# EAGLE design BatteryPower (EAGLE 6.5.0)
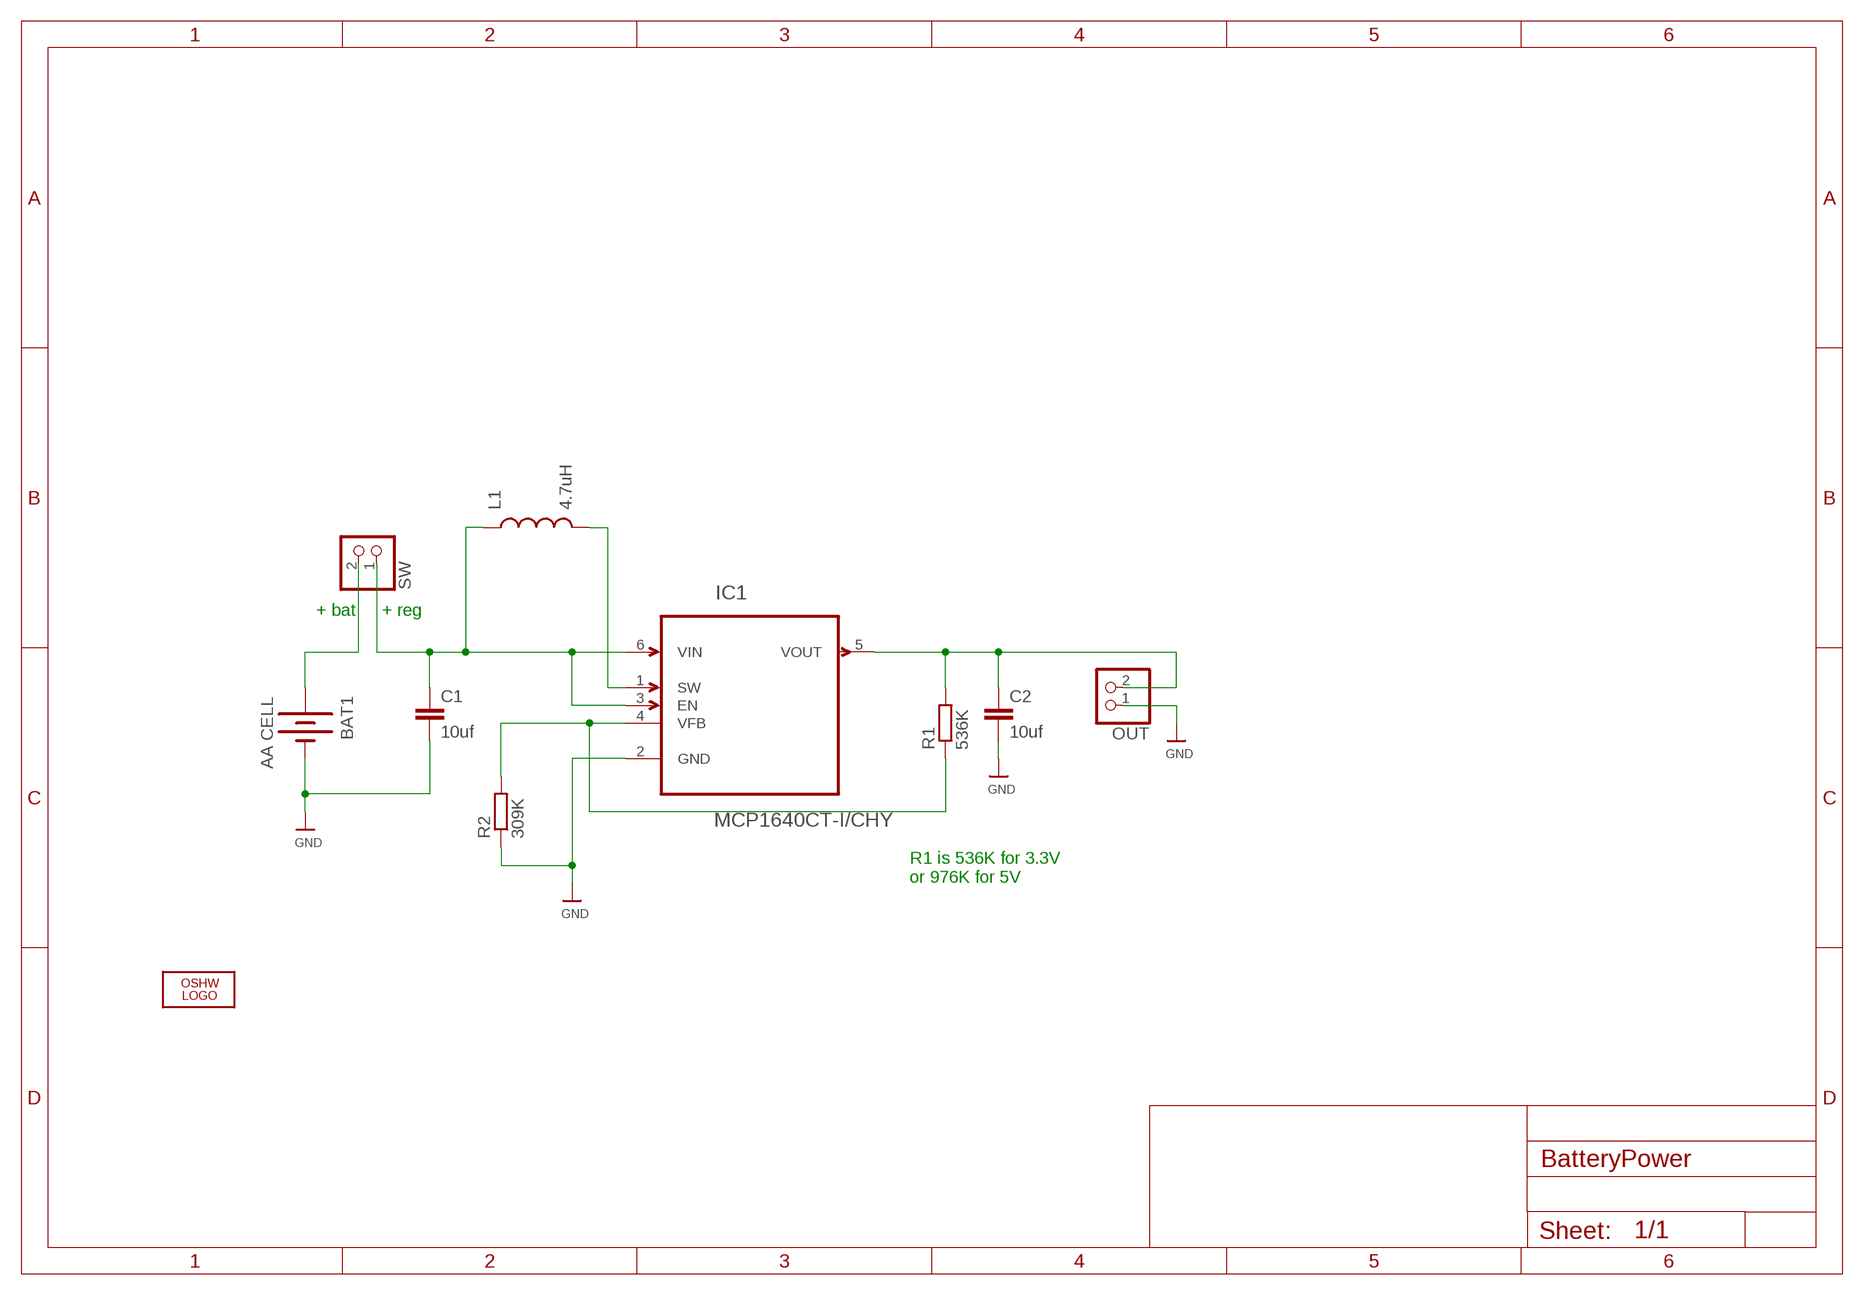
[diagram p0: schematic, sheet 1]

## Parts
BAT1  AA CELL  BATTERYAA  [BATTERY-AA]
C1  10uf  C-EUC0805  [C0805]
C2  10uf  C-EUC0805  [C0805]
IC1  MCP1640CT-I/CHY  [SOT95P270X145-6N]
L1  4.7uH  INDUCTORCR75  [CR75]
LOGO1  OSHW_LOGO_8MILX0150-NT  [OSHW_8X150_NOTEXT]
OUT  PINHD-1X2/90  [1X02/90]
R1  536K  R-EU_R0603  [R0603]
R2  309K  R-EU_R0603  [R0603]
SW  PINHD-1X2/90  [1X02/90]

## Nets
GND: BAT1.GND@1(-) C1.2 C2.2 IC1.2(GND) OUT.1 R2.1
N$1: C1.1 IC1.3(EN) IC1.6(VIN) L1.P$1 SW.1
N$2: IC1.1(SW) L1.P$2
N$5: IC1.4(VFB) R1.1 R2.2
N$6: C2.1 IC1.5(VOUT) OUT.2 R1.2
N$8: BAT1.PWR@1(+) SW.2

## Notes on the sheet
- + bat | + reg
- R1 is 536K for 3.3V
  or 976K for 5V

## Library data of the parts
BAT1 = SparkFun:BATTERY: Battery Holders Various common sizes : AA, AAA, 20mm coin cell and 12mm coin cell.
C1 C2 = rcl:C-EU: CAPACITOR, European symbol
IC1 = MCP1640:MCP1640CT-I/CHY: Synchronous Boost Regulator; MPN: MCP1640CT-I/CHY; OC_FARNELL: 1800208; OC_NEWARK: 73R3626; PACKAGE: SOT-6; SUPPLIER: Microchip
L1 = SparkFun:INDUCTOR: Inductors Basic Inductor/Choke - 0603 and 1206. Footprints are not proven and vary greatly between part numbers.
LOGO1 = ohw-logo:OSHW_LOGO_8MIL
OUT SW = pinhead:PINHD-1X2: PIN HEADER
R1 R2 = rcl:R-EU_: RESISTOR, European symbol

## Board
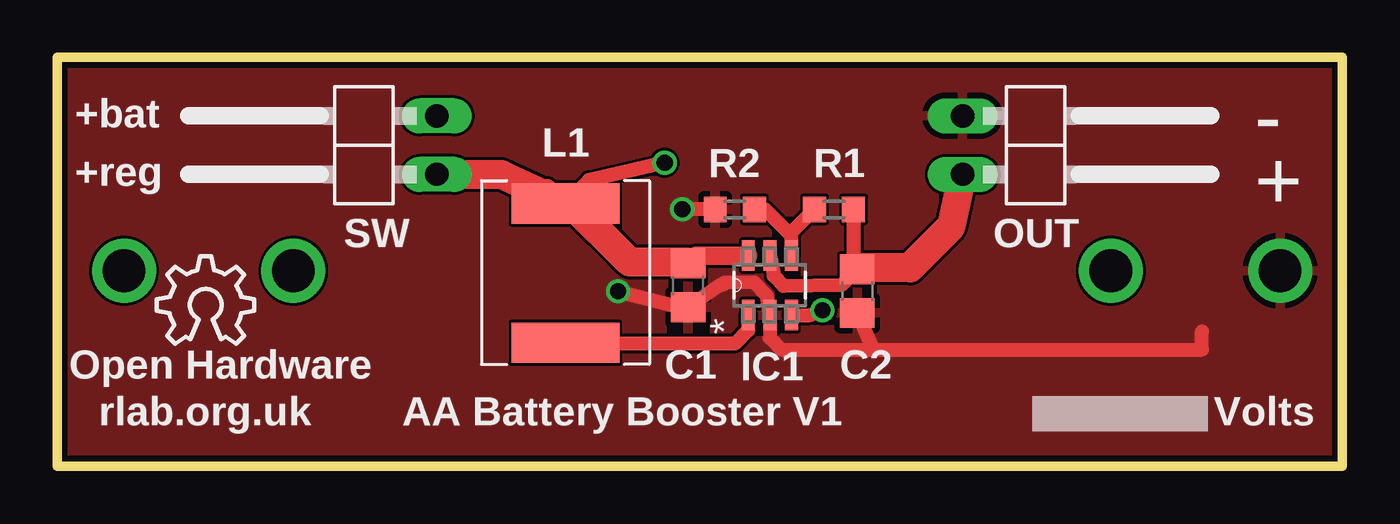
[diagram p1: board, top side]
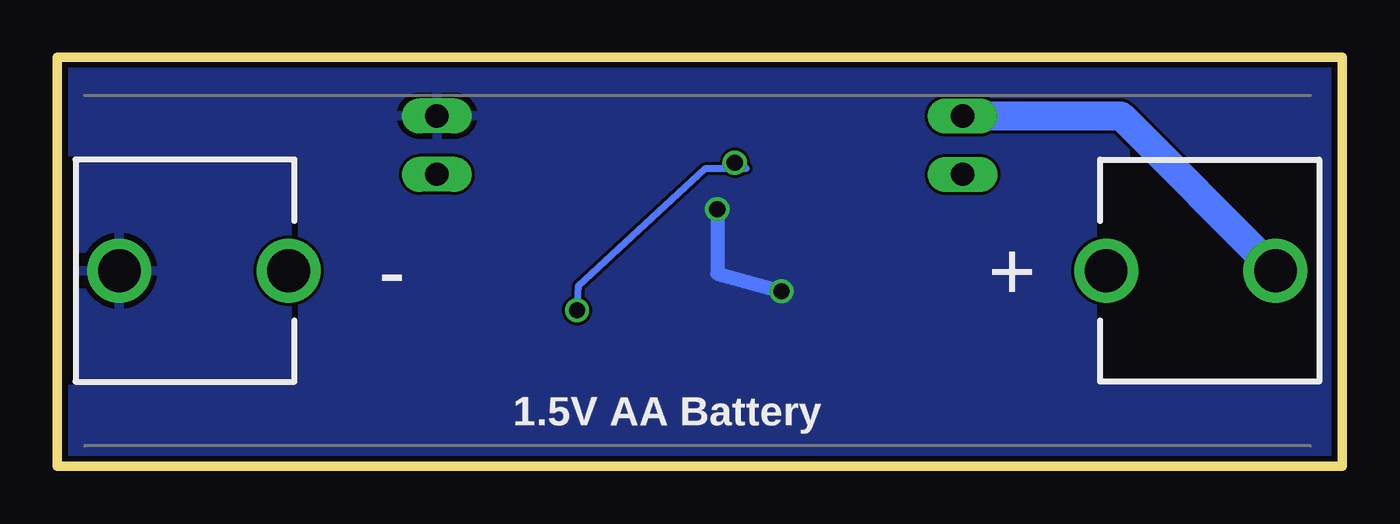
[diagram p2: board, bottom side, seen from below]

Size 55.88 x 17.78 mm. Coordinates in mm from the lower left corner, seen from the top.
Outline: 0,0 0,17.78 55.88,17.78 55.88,0 0,0
Copper layers (1*16): Top 0.035mm / dielectric 1.5mm / Bottom 0.035mm
Design rules "dirt_cheap_dirty_boards.v1": minimum track width 5mil, minimum drill 12mil, track to track 5mil, track to pad 5mil, pad to pad 5mil, via to via 5mil, smd to smd 0mil, copper to edge 10mil, drill to drill 10mil, minimum pad ring 10mil, minimum via ring 6mil, stop-mask expansion 2mil, vias tented up to drill 25mil, thermal gap 10mil

### Footprints (pad centres in the part's own frame; a part is rotated, then mirrored left to right if it is on the bottom)
BATTERY-AA = drill 1.854: GND@1 25.146,0; GND@2 17.78,0; PWR@1 -25.146,0; PWR@2 -17.78,0
C0805 = smd 1.3 x 1.5: 1 -0.95,0; 2 0.95,0
SOT95P270X145-6N = smd 1.321 x 0.559: 1 -1.295,0.94; 2 -1.295,0; 3 -1.295,-0.94; 4 1.295,-0.94; 5 1.295,0; 6 1.295,0.94
CR75 = smd 1.75 x 4.7: P$1 0,0; P$2 6.05,0
1X02/90 = drill 1.016 long: 1 -1.27,-3.81; 2 1.27,-3.81
R0603 = smd 1 x 1.1: 1 -0.85,0; 2 0.85,0

### Placement (x,y rotation side)
BAT1  28.04,8.51 180 bottom
C1  27.43,7.87 270 top
C2  34.8,7.62 270 top
IC1  30.99,7.87 90 top
L1  22.1,11.43 270 top
LOGO1  4.32,5.33 0 top
OUT  43.18,13.97 270 top
R1  33.78,11.18 0 top
R2  29.46,11.18 0 top
SW  12.7,13.97 90 top

### Tracks (layer width: path | path; a pad name or v marks a point on that pad's centre or on a via)
GND  (via drill 0.7)
  Top 0.61: 35.49,5.08 31.5,5.08 30.99,5.59 IC1.2 30.86,7.42 30.3,8 28.98,7.98 29.01,7.92 28.76,7.85 C1.2 27.37,6.86 v24.38,7.62 | 35.49,5.08 C2.2 | 35.49,5.08 49.78,5.08 49.78,5.87 | R2.1 v27.18,11.18
  Bottom 0.61: v27.18,11.18 27.18,8.38 v24.38,7.62
  pour Bottom: 0,0 0,17.78 55.88,17.78 55.88,0
  pour Top: 0,0 0,17.78 55.88,17.78 55.88,0
N$1  (via drill 0.7)
  Top 0.61: 21.34,12.19 L1.P$1 23.11,12.45 v26.42,13.21 | IC1.3 32.74,6.58 v33.27,6.78
  Top 0.813: IC1.6 27.78,9.17 C1.1
  Top 1.27: C1.1 27.37,8.89 24.89,8.89 22.35,11.43 L1.P$1 19.3,12.7 SW.1
  Bottom 0.305: v33.27,6.78 33.22,7.85 27.69,12.95 25.91,12.95 v26.42,13.21
N$2
  Top 0.61: IC1.1 30.05,5.92 29.46,5.33 22.14,5.33 L1.P$2
N$5
  Top 0.61: IC1.4 31.93,10.03 | 31.93,10.03 31.93,10.17 R1.1 | R2.2 30.79,11.18 31.93,10.03
N$6
  Top 0.61: R1.2 34.63,8.74 C2.1 34.13,7.9 31.57,7.85 31.17,8.28 IC1.5
  Top 1.27: OUT.2 38.86,10.41 37.08,8.64 34.86,8.64 C2.1
N$8
  Bottom 1.27: SW.2 9.63,15.24 BAT1.PWR@1

### Text on the board
tPlace: +bat | - | +reg | +
tNames: L1 | Open Hardware | rlab.org.uk | AA Battery Booster V1 | Volts
bNames: 1.5V AA Battery